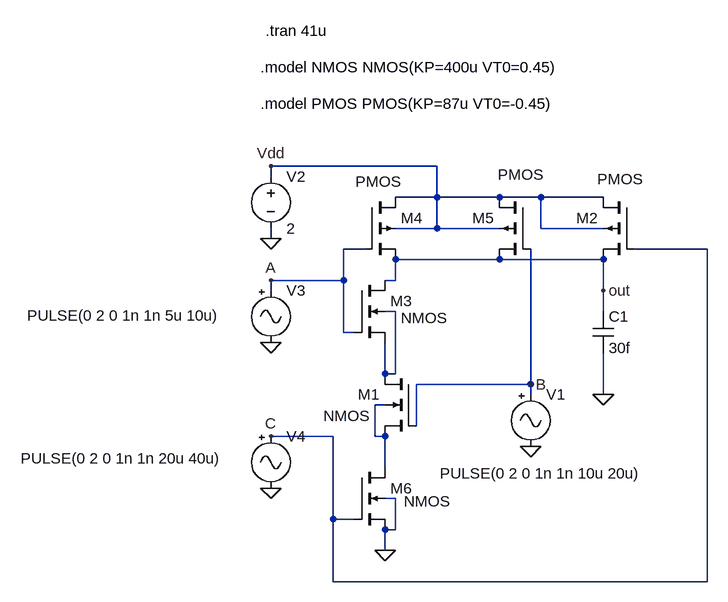
[diagram p0: schematic NAND3.asc]
NAND3.asc, the LTspice schematic file:
Version 4
SHEET 1 1300 680
WIRE 608 -592 352 -592
WIRE 352 -576 352 -592
WIRE 608 -544 608 -592
WIRE 608 -544 544 -544
WIRE 704 -544 608 -544
WIRE 768 -544 704 -544
WIRE 864 -544 768 -544
WIRE 608 -496 608 -544
WIRE 608 -496 544 -496
WIRE 704 -496 608 -496
WIRE 768 -496 768 -544
WIRE 864 -496 768 -496
WIRE 352 -480 352 -496
WIRE 496 -464 464 -464
WIRE 1024 -464 912 -464
WIRE 704 -448 544 -448
WIRE 864 -448 704 -448
WIRE 464 -416 464 -464
WIRE 464 -416 352 -416
WIRE 544 -416 544 -448
WIRE 544 -416 528 -416
WIRE 352 -400 352 -416
WIRE 864 -400 864 -448
WIRE 544 -368 528 -368
WIRE 864 -368 864 -400
WIRE 464 -336 464 -416
WIRE 480 -336 464 -336
WIRE 528 -272 528 -320
WIRE 544 -272 544 -368
WIRE 544 -272 528 -272
WIRE 752 -256 752 -464
WIRE 752 -256 576 -256
WIRE 752 -240 752 -256
WIRE 864 -240 864 -304
WIRE 528 -224 512 -224
WIRE 576 -192 576 -256
WIRE 448 -176 352 -176
WIRE 512 -176 512 -224
WIRE 528 -176 512 -176
WIRE 528 -128 528 -176
WIRE 544 -80 528 -80
WIRE 448 -48 448 -176
WIRE 480 -48 448 -48
WIRE 544 -32 544 -80
WIRE 544 -32 528 -32
WIRE 528 0 528 -32
WIRE 448 48 448 -48
WIRE 1024 48 1024 -464
WIRE 1024 48 448 48
FLAG 352 -320 0
FLAG 352 -480 0
FLAG 864 -240 0
FLAG 752 -160 0
FLAG 528 0 0
FLAG 864 -400 out
FLAG 752 -256 B
FLAG 352 -592 Vdd
FLAG 352 -96 0
FLAG 352 -416 A
FLAG 352 -176 C
SYMBOL nmos4 576 -272 M0
WINDOW 3 71 65 Left 2
SYMATTR InstName M1
SYMATTR Value2 l=0.15u w=1.86u
SYMBOL voltage 352 -592 R0
WINDOW 123 0 0 Left 0
WINDOW 39 0 0 Left 0
SYMATTR InstName V2
SYMATTR Value 2
SYMBOL cap 848 -368 R0
SYMATTR InstName C1
SYMATTR Value 30f
SYMBOL nmos4 480 -416 R0
WINDOW 3 72 58 Left 2
SYMATTR InstName M3
SYMATTR Value2 l=0.15u w=1.86u
SYMBOL pmos4 496 -544 R0
WINDOW 3 -14 -24 Left 2
SYMATTR InstName M4
SYMATTR Value2 l=0.15u w=2.85u
SYMBOL pmos4 752 -544 M0
WINDOW 3 -20 -35 Left 2
SYMATTR InstName M5
SYMATTR Value2 l=0.15u w=2.85u
SYMBOL Misc\\signal 752 -256 R0
WINDOW 3 -140 137 Left 2
WINDOW 123 0 0 Left 0
WINDOW 39 0 0 Left 0
SYMATTR InstName V1
SYMATTR Value PULSE(0 2 0 1n 1n 10u 20u)
SYMBOL Misc\\signal 352 -416 R0
WINDOW 3 -375 54 Left 2
WINDOW 123 0 0 Left 0
WINDOW 39 0 0 Left 0
SYMATTR InstName V3
SYMATTR Value PULSE(0 2 0 1n 1n 5u 10u)
SYMBOL pmos4 912 -544 M0
WINDOW 3 -13 -28 Left 2
SYMATTR InstName M2
SYMATTR Value2 l=0.15u w=2.85u
SYMBOL nmos4 480 -128 R0
WINDOW 3 77 52 Left 2
SYMATTR InstName M6
SYMATTR Value2 l=0.15u w=1.86u
SYMBOL Misc\\signal 352 -192 R0
WINDOW 3 -385 50 Left 2
WINDOW 123 0 0 Left 0
WINDOW 39 0 0 Left 0
SYMATTR InstName V4
SYMATTR Value PULSE(0 2 0 1n 1n 20u 40u)
TEXT 336 -744 Left 2 !.model NMOS NMOS(KP=400u VT0=0.45)
TEXT 336 -688 Left 2 !.model PMOS PMOS(KP=87u VT0=-0.45)
TEXT 344 -800 Left 2 !.tran 41u

The netlist it stands for:
* NAND3.asc
M1 N001 B N002 N002 NMOS l=0.15u w=1.86u
V2 Vdd 0 2
C1 out 0 30f
M3 out A N001 N001 NMOS l=0.15u w=1.86u
M4 Vdd A out Vdd PMOS l=0.15u w=2.85u
M5 Vdd B out Vdd PMOS l=0.15u w=2.85u
V1 B 0 PULSE(0 2 0 1n 1n 10u 20u)
V3 A 0 PULSE(0 2 0 1n 1n 5u 10u)
M2 Vdd C out Vdd PMOS l=0.15u w=2.85u
M6 N002 C 0 0 NMOS l=0.15u w=1.86u
V4 C 0 PULSE(0 2 0 1n 1n 20u 40u)
.model NMOS NMOS
.model PMOS PMOS
.lib standard.mos
.model NMOS NMOS(KP=400u VT0=0.45)
.model PMOS PMOS(KP=87u VT0=-0.45)
.tran 41u
.backanno
.end